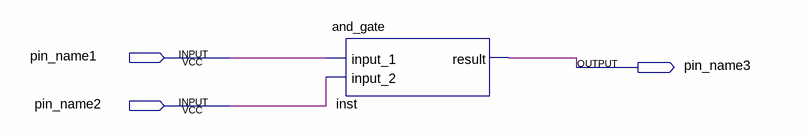
[diagram p0: schematic sheet]
// Quartus schematic andgate.bdf as structural Verilog: 1 symbols, 3 pins
module andgate (
  input  pin_name1,
  input  pin_name2,
  output pin_name3
);

  and_gate inst (.input_1(pin_name1), .input_2(pin_name2), .result(pin_name3));
endmodule
